# Altium schematic sheet Sheet.SchDoc
size OrCAD A
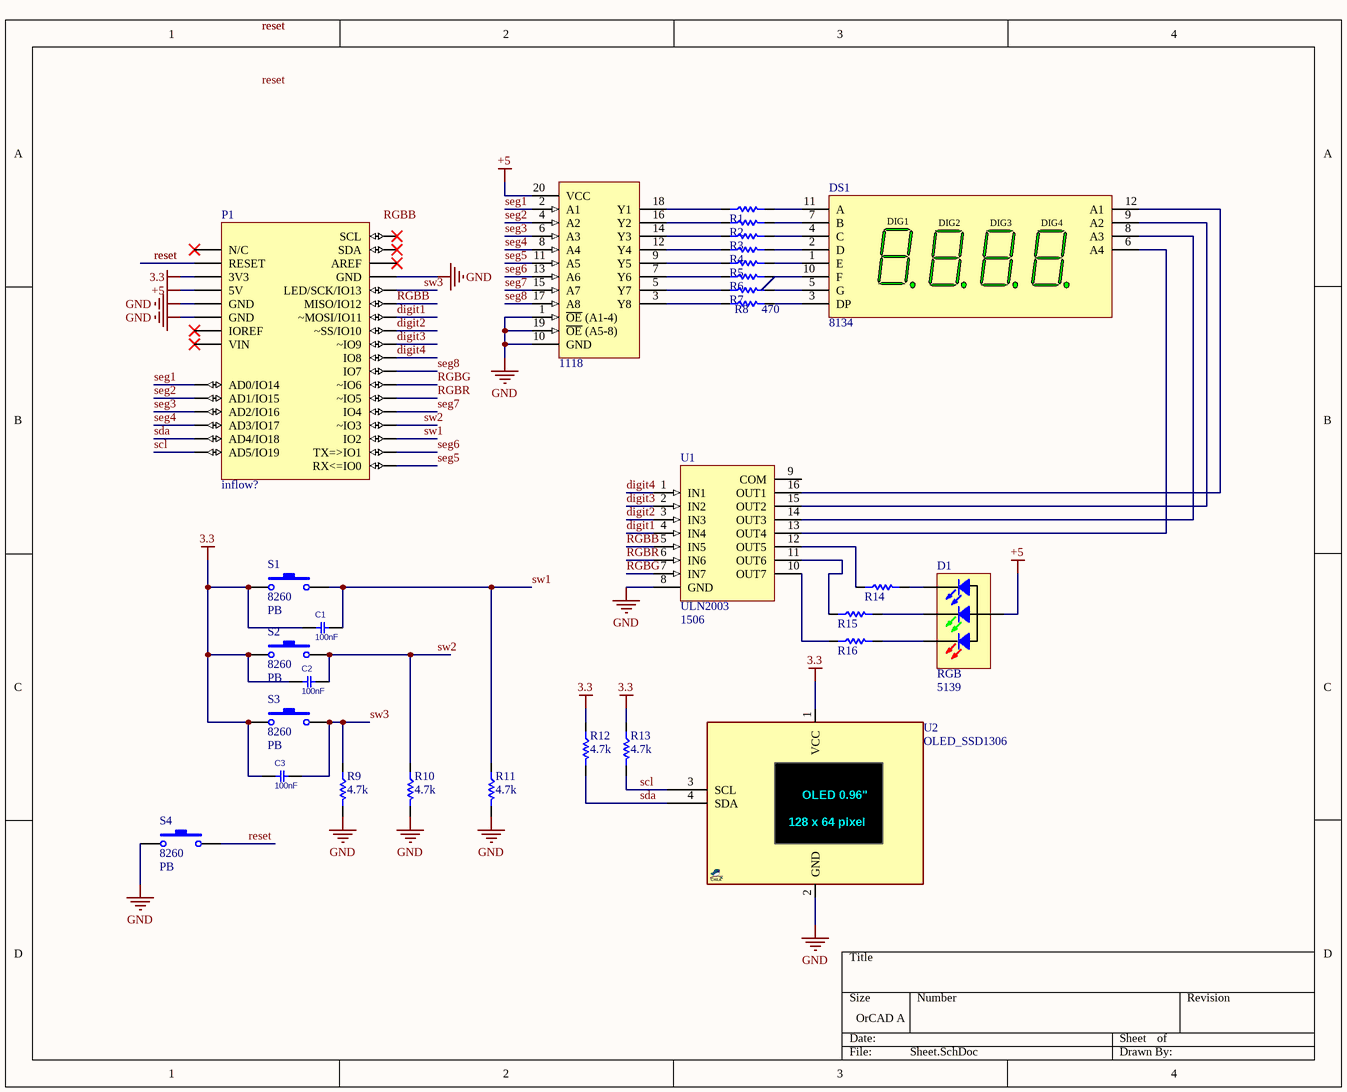
[diagram p0: Sheet.SchDoc]

## Parts
?  Inflow: 1118  [PDIP20]  (hidden comment: 74HCT244)
C1  100nF  [C_CER_D5]
C2  100nF  [C_CER_D5]
C3  100nF  [C_CER_D5]
D1  Inflow: 5139  [RGB_DIP]  (hidden comment: RGB)
DS1  Inflow: 8134  [7Seg-MPX4-30.2x14.1mm]  (hidden comment: 4Digit, Red)
P1  Inflow: inflow?  [Arduino_uno_U_1]  (hidden comment: UNO)  (no BOM)
R1  470  [RES 1206 (3216X08L)]  (value not drawn)
R2  470  [RES 1206 (3216X08L)]  (value not drawn)
R3  470  [RES 1206 (3216X08L)]  (value not drawn)
R4  470  [RES 1206 (3216X08L)]  (value not drawn)
R5  470  [RES 1206 (3216X08L)]  (value not drawn)
R6  470  [RES 1206 (3216X08L)]  (value not drawn)
R7  470  [RES 1206 (3216X08L)]  (value not drawn)
R8  470  [RES 1206 (3216X08L)]
R9  4.7k  [RES 1206 (3216X08L)]
R10  4.7k  [RES 1206 (3216X08L)]
R11  4.7k  [RES 1206 (3216X08L)]
R12  4.7k  [RES 1206 (3216X08L)]
R13  4.7k  [RES 1206 (3216X08L)]
R14  470  [RES 1206 (3216X08L)]  (value not drawn)
R15  470  [RES 1206 (3216X08L)]  (value not drawn)
R16  470  [RES 1206 (3216X08L)]  (value not drawn)
S1  Inflow: 8260  [SW_PB_SMD_2PIN_SPST_6X3X2]  (hidden comment: PB)
S2  Inflow: 8260  [SW_PB_SMD_2PIN_SPST_6X3X2]  (hidden comment: PB)
S3  Inflow: 8260  [SW_PB_SMD_2PIN_SPST_6X3X2]  (hidden comment: PB)
S4  Inflow: 8260  [SW_PB_SMD_2PIN_SPST_6X3X2]  (hidden comment: PB)
U1  Inflow: 1506  [CDIP16]  (hidden comment: ULN2003)
U2  OLED_SSD1306  [OLED_SSD1306_64_I2C]

## Nets
3.3: C1.1 C2.1 C3.1 P1.3(3V3) R12.1 R13.1 S1.1 S2.1 S3.1 U2.1(VCC)
+5: ?.20(VCC) D1.2(CA) P1.4(5V)
GND: ?.1(~{OE}_(A1-4)) ?.10(GND) ?.19(~{OE}_(A5-8)) P1.5(GND) P1.6(GND) P1.29(GND) R9.2 R10.2 R11.2 S4.1 U1.8(GND) U2.2(GND)
digit1: P1.26(~MOSI/IO11) U1.4(IN4)
digit2: P1.25(~SS/IO10) U1.3(IN3)
digit3: P1.24(~IO9) U1.2(IN2)
digit4: P1.23(IO8) U1.1(IN1)
reset: P1.2(RESET) S4.2
RGBB: P1.27(MISO/IO12) U1.5(IN5)
RGBG: P1.21(~IO6) U1.7(IN7)
RGBR: P1.20(~IO5) U1.6(IN6)
scl: P1.14(AD5/IO19) R13.2 U2.3(SCL)
sda: P1.13(AD4/IO18) R12.2 U2.4(SDA)
seg1: ?.2(A1) P1.9(AD0/IO14)
seg2: ?.4(A2) P1.10(AD1/IO15)
seg3: ?.6(A3) P1.11(AD2/IO16)
seg4: ?.8(A4) P1.12(AD3/IO17)
seg5: ?.11(A5) P1.15(RX<=IO0)
seg6: ?.13(A6) P1.16(TX=>IO1)
seg7: ?.15(A7) P1.19(IO4)
seg8: ?.17(A8) P1.22(IO7)
sw1: C1.2 P1.17(IO2) R11.1 S1.2
sw2: C2.2 P1.18(~IO3) R10.1 S2.2
sw3: C3.2 P1.28(LED/SCK/IO13) R9.1 S3.2
Net?_3: ?.3(Y8) R8.1
Net?_5: ?.5(Y7) R7.1
Net?_7: ?.7(Y6) R6.1
Net?_9: ?.9(Y5) R5.1
Net?_12: ?.12(Y4) R4.1
Net?_14: ?.14(Y3) R3.1
Net?_16: ?.16(Y2) R2.1
Net?_18: ?.18(Y1) R1.1
NetD1_1: D1.1(R) R16.2
NetD1_3: D1.3(G) R15.2
NetD1_4: D1.4(B) R14.2
NetDS1_1: DS1.1(E) R5.2
NetDS1_2: DS1.2(D) R4.2
NetDS1_3: DS1.3(DP) R8.2
NetDS1_4: DS1.4(C) R3.2
NetDS1_5: DS1.5(G) R7.2
NetDS1_6: DS1.6(A4) U1.13(OUT4)
NetDS1_7: DS1.7(B) R2.2
NetDS1_8: DS1.8(A3) U1.14(OUT3)
NetDS1_9: DS1.9(A2) U1.15(OUT2)
NetDS1_10: DS1.10(F) R6.2
NetDS1_11: DS1.11(A) R1.2
NetDS1_12: DS1.12(A1) U1.16(OUT1)
NetR14_1: R14.1 U1.12(OUT5)
NetR15_1: R15.1 U1.11(OUT6)
NetR16_1: R16.1 U1.10(OUT7)

Not connected (* = marked no-connect by the designer): P1 1(N/C)* 7(IOREF)* 8(VIN)* 30(AREF)* 31(SDA)* 32(SCL)*; U1 9(COM)

## Notes on the sheet
- Labels drawn without touching a wire or pin: reset, RGBB
- (in symbol ModSen_7Seg_MPX4_Red_CA) DIG1; DIG2; DIG3; DIG4
- (in symbol OLED_SSD1306_64_I2C) OLED 0.96"; 128 x 64 pixel

## Library data of the parts
? = IC_Logic_74HCT244: Octal Bus Buffer with 3 State Outputs (Non Inverted); Rating: 8b; Validation: NT; Type: 3-State Non-Inverting; Package: Dip; Value: 74HCT244
C1-C3 = CAP_THD_CERML: CAP, THD, CER MULTI LAYER,; PARAM: 50V; DESC: CAP, CER MULTI LAYER,; MANF_P#: MANF_PART#; PRICE: 100= 1$; MANF: MANF; PARAM2: PARAM2; ASSEMBLY: ASSEMBLY; VALUE: 100nF
D1 = Semi_LED_RGB_THT: SMD 5050 LED RGB and Other; Rating: 5V; Type: CA; Validation: Valid; Package: Dip; Value: RGB
DS1 = ModSen_7Seg_MPX4_Red_CA: 7Segment-MPX4-CA; Rating: Rating?; Type: Type?; Validation: NT; Value: 4Digit, Red; Package: Package?
P1 = Con_Arduino_UNO_U: Arduino uno up; Rating: Rating?; Validation: Valid; Value: UNO; Package: Package?; Type: Type?
R1-R5 = Res_SMD_1206: Resistor; Inflow: inflow?; Rating: 0.25W; Validation: Valid; Value: Value?; Package: 1206; Type: 10%
R6-R16 = Res_SMD_1206: Resistor; Inflow: inflow?; Rating: 0.25W; Validation: Valid; Package: 1206; Type: 10%
  R6-R8 R14-R16: Value: 470
  R9-R13: Value: 4.7k
S1-S4 = SW_PushButton_2_SMD: SMT Tactile ‎Switch; Rating: 2b; Validation: Valid; Type: Vertical; Package: SMD; Value: PB
U1 = IC_Driver_ULN2003: Seven darlington array drivers; Rating: Rating?; Validation: Valid; Package: SO-16; Type: Driver; Value: ULN2003
U2 = OLED_SSD1306_64_I2C: OLED, SSD1306, 0.96", 128X64, BREAKOUT I2C; MANF_P#: OLED_SSD1306_I2C; PARAM2: 3.3/5VCC, -20~70oC; PARAM: 2 Colors, 0.96", 128X64; MANF: -; VALUE: OLED_SSD1306